# EasyEDA schematic 1-Schematic_Pro_CTRL_2_Buck.json
TITLE: Controlador Buck DC-DC; REV: 1.0; Date: 2026-04-26; Sheet: 1/1; Drawn By: sotogabrielaidea; Company: Your Company
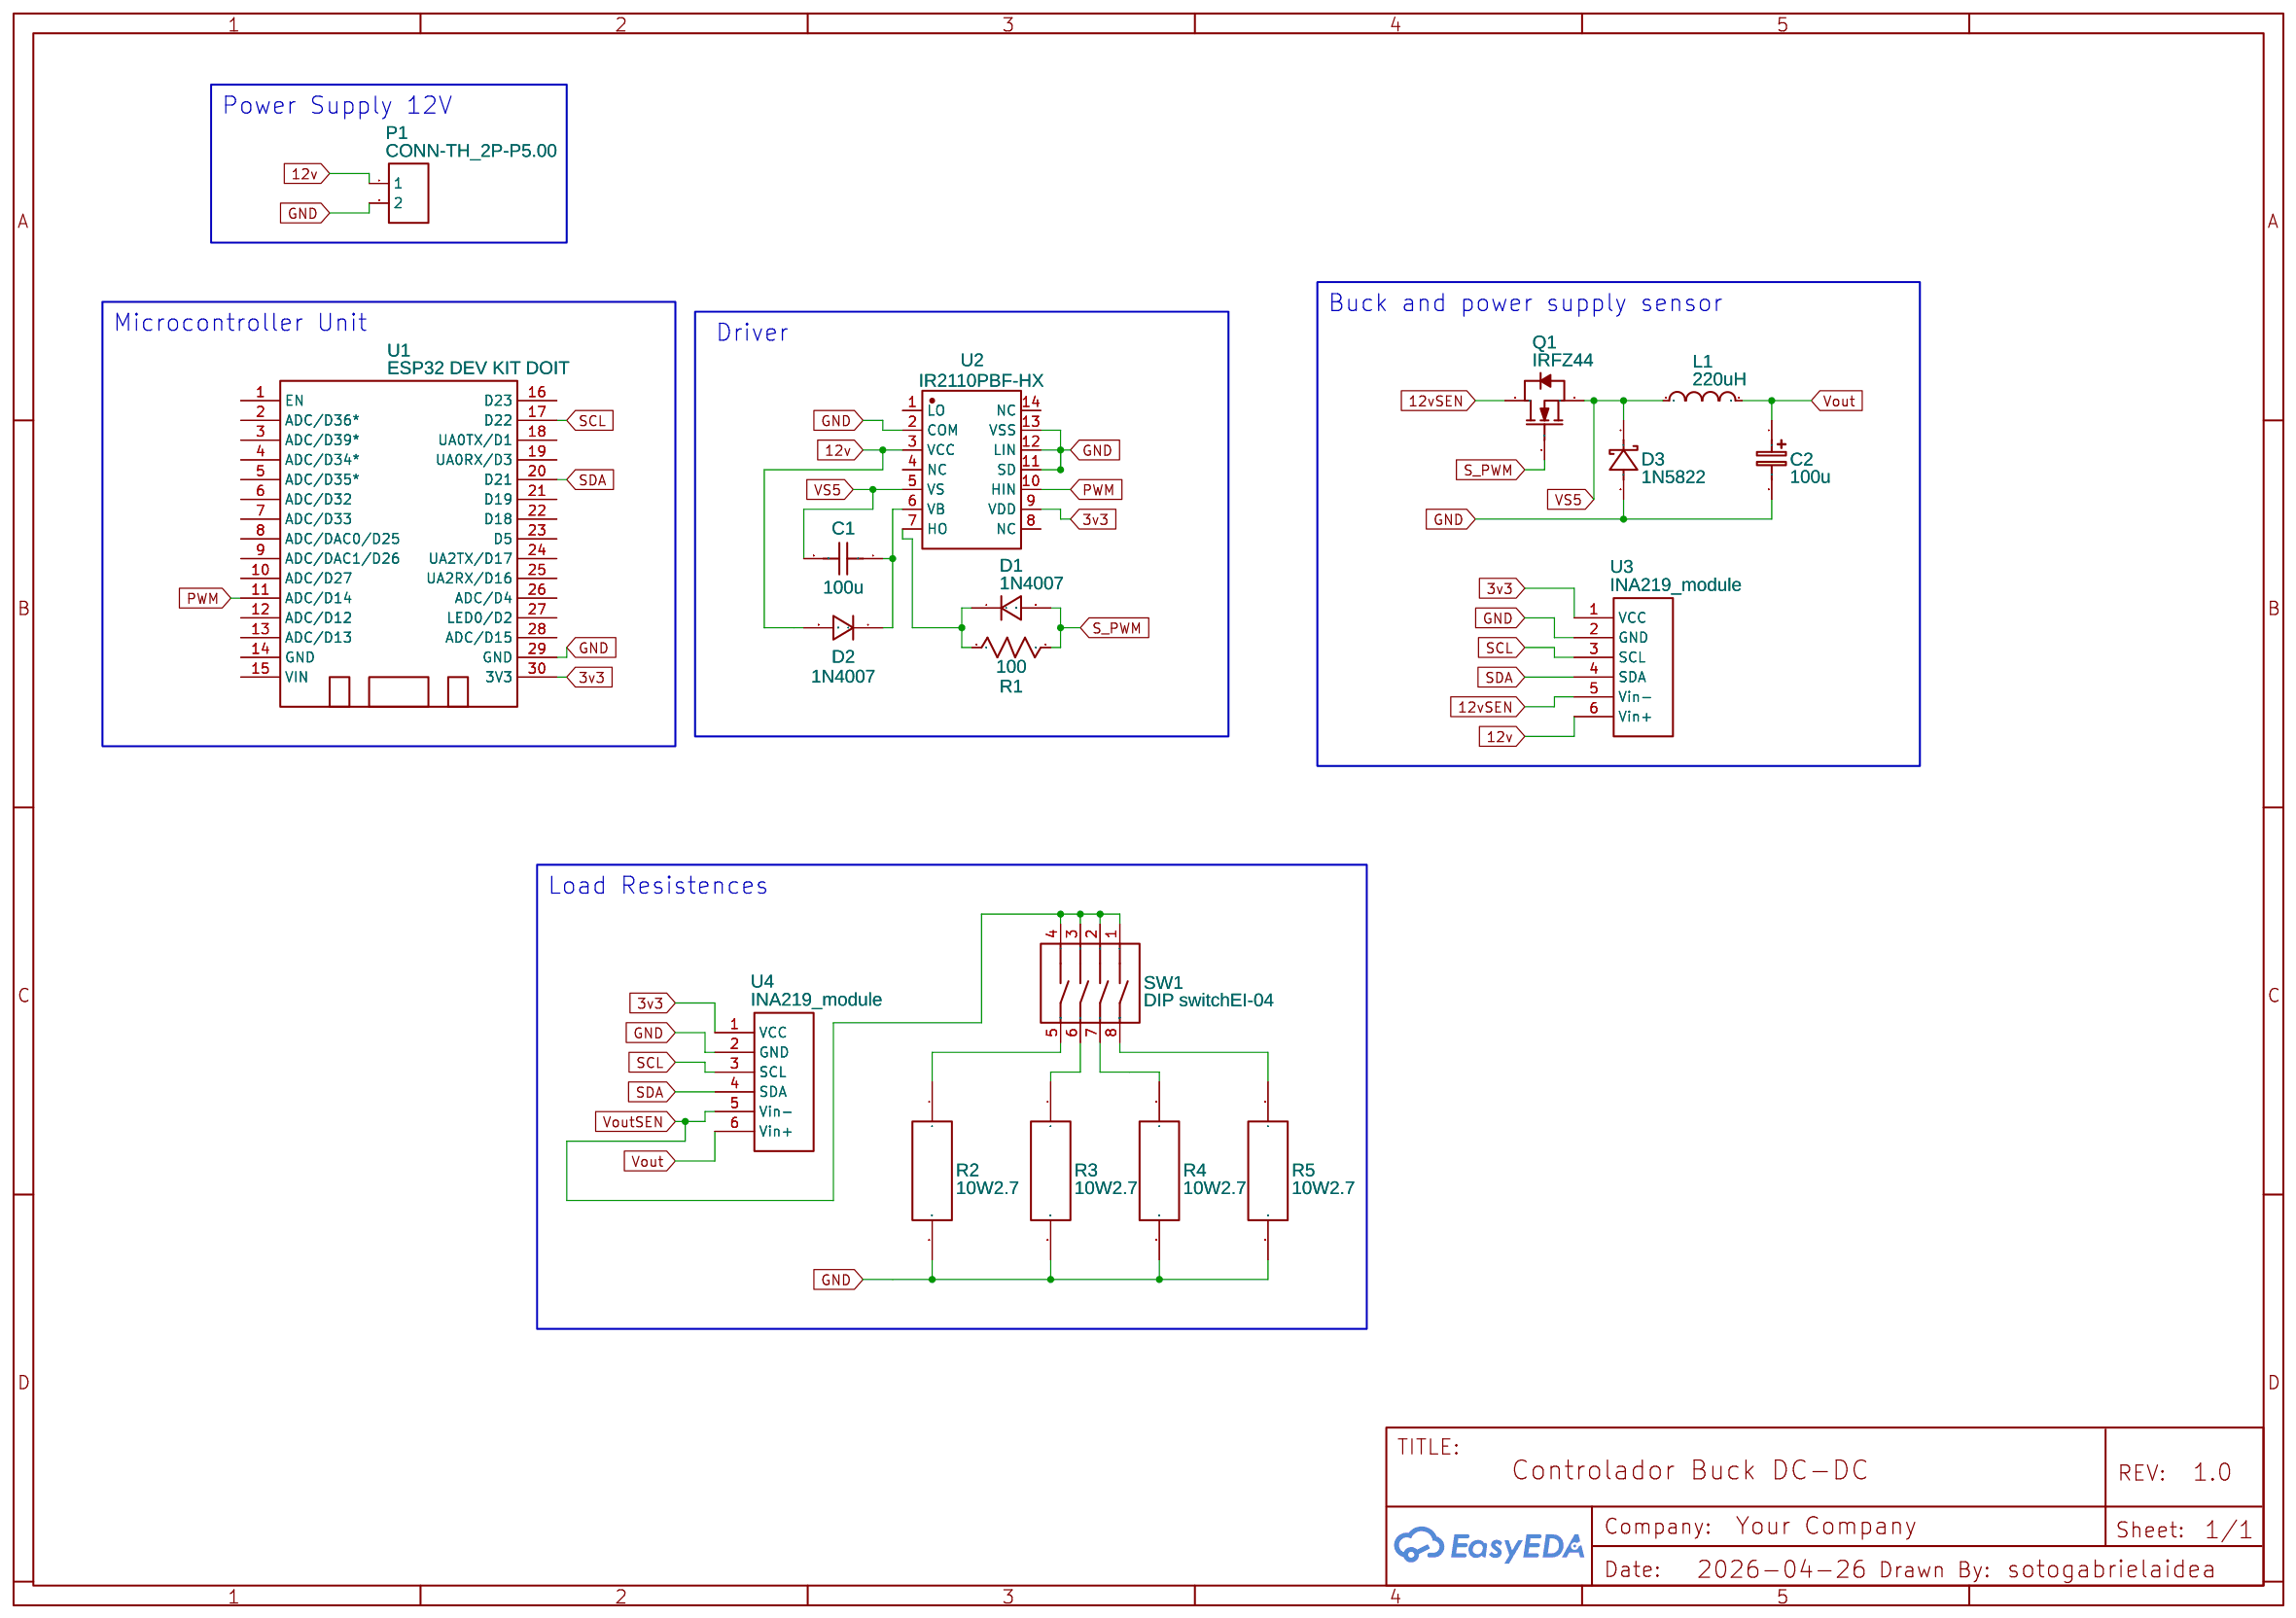
[diagram p0: schematic sheet]

## Parts
C1  100u  [RAD-0.1]
C2  100u  [CAP-D10.0×F5.0]
D1  1N4007  [DO-41_BD2.4-L4.7-P8.70-D0.9-RD]
D2  1N4007  [DO-41_BD2.4-L4.7-P8.70-D0.9-RD]
D3  1N5822  [DO-201AD_BD5.3-L8.4-P12.50-D1.4-RD]
L1  220uH  [IND-TH_L13.0-W6.0-P6.00-D0.7]
P1  CONN-TH_2P-P5.00  [CONN-TH_2P-P5.00]
Q1  IRFZ44  [TO-220-3_L10.0-W4.6-P2.54-L]
R1  100  [R_AXIAL-0.5]
R2  10W2.7  [LARGE-CERAMIC-RESISTOR-10W-6.8OHM]
R3  10W2.7  [LARGE-CERAMIC-RESISTOR-10W-6.8OHM]
R4  10W2.7  [LARGE-CERAMIC-RESISTOR-10W-6.8OHM]
R5  10W2.7  [LARGE-CERAMIC-RESISTOR-10W-6.8OHM]
SW1  DIP switchEI-04  [SW-TH_DIPSWITCHEI-04]
U1  ESP32 DEV KIT DOIT  [DOIT-ESP32-DEVKIT-V1]
U2  IR2110PBF-HX  [PDIP-14_L19.3-W6.4-P2.54-LS7.6-BL]
U3  INA219_module  [INA219_MODULE]
U4  INA219_module  [INA219_MODULE]

## Library data of the parts
C1 = C_RAD-0.1_US: Contributor: LCEDA_Lib
C2 = CE_TH_D10.0×F5.0_EU: Contributor: LCEDA_Lib
D1 D2 = 1N4007: Supplier: LCSC; Manufacturer: SEMTECH; Supplier Part: C106903; Contributor: LCEDA_Lib
D3 = 1N5822_C47345510: Supplier: LCSC; Supplier Part: C47345510; Manufacturer: R+O(宏嘉诚); JLCPCB Part Class: Extended Part; Contributor: lcsc
L1 = TINDUCTOR-5MMX0.7: Contributor: LCSC; Supplier: LCSC; Supplier Part: C9900004579; Manufacturer: null; JLCPCB Part Class: Extended Part
P1 = CONN-TH_2P-P5.00: Supplier: LCSC; Contributor: LCEDA_Lib
Q1 = HIRFZ44NPBF: Supplier: LCSC; Supplier Part: C41381868; Manufacturer: HXY MOSFET(华轩阳电子); JLCPCB Part Class: Extended Part; Contributor: lcsc
R1 = R_AXIAL-0.5_US: Contributor: LCEDA_Lib
R2-R5 = 10W2.7: Manufacturer Part: Yontex MKP 250V 6.8uF; Contributor: zlabanica; Package Display: No
SW1 = DIP switchEI-04: Supplier: LCSC; Manufacturer: 圜达; Manufacturer Part: 拨码开关EI-04; Supplier Part: C99987; JLCPCB Part Class: Extended Part
U1 = ESP32 DEV KIT DOIT: Contributor: ConceitoTeam
U2 = IR2110PBF-HX: Supplier: LCSC; Supplier Part: C52191358; Manufacturer: ZHHXDZ(海芯电子); Contributor: lcsc; JLCPCB Part Class: Extended Part
U3 U4 = INA219_module: Contributor: averagegamer21

## Nets
3v3: U1.30(3V3) U2.9(VDD) U3.1(VCC) U4.1(VCC)
12v: D2.2 P1.1 U2.3(VCC) U3.6(Vin+)
12vSEN: Q1.2(D) U3.5(Vin-)
GND: C2.2 D3.2(A) P1.2 R2.2 R3.2 R4.2 R5.2 U1.29(GND) U2.2(COM) U2.11(SD) U2.12(LIN) U2.13(VSS) U3.2(GND) U4.2(GND)
PWM: U1.11(ADC/D14) U2.10(HIN)
S_PWM: D1.2 Q1.1(G) R1.2
SCL: U1.17(D22) U3.3(SCL) U4.3(SCL)
SDA: U1.20(D21) U3.4(SDA) U4.4(SDA)
Vout: C2.1 L1.2 U4.6(Vin+)
VoutSEN: SW1.1 SW1.2 SW1.3 SW1.4 U4.5(Vin-)
VS5: C1.2 D3.1(K) L1.1 Q1.3(S) U2.5(VS)
Net-(C1-1): C1.1 D2.1 U2.6(VB)
Net-(D1-1): D1.1 R1.1 U2.7(HO)
Net-(R2-1): R2.1 SW1.5
Net-(R3-1): R3.1 SW1.6
Net-(R4-1): R4.1 SW1.7
Net-(R5-1): R5.1 SW1.8

Not connected (* = marked no-connect by the designer): U1 1(EN) 2(ADC/D36*) 3(ADC/D39*) 4(ADC/D34*) 5(ADC/D35*) 6(ADC/D32) 7(ADC/D33) 8(ADC/DAC0/D25) 9(ADC/DAC1/D26) 10(ADC/D27) 12(ADC/D12) 13(ADC/D13) 14(GND) 15(VIN) 16(D23) 18(UA0TX/D1) 19(UA0RX/D3) 21(D19) 22(D18) 23(D5) 24(UA2TX/D17) 25(UA2RX/D16) 26(ADC/D4) 27(LED0/D2) 28(ADC/D15); U2 1(LO) 4(NC) 8(NC) 14(NC)

## Notes on the sheet
- Power Supply 12V
- Buck and power supply sensor
- Microcontroller Unit
- Driver
- Load Resistences
